# Altium schematic sheet Module-MCU.SchDoc
size A2; SheetNumber: 1; SheetTotal: 1
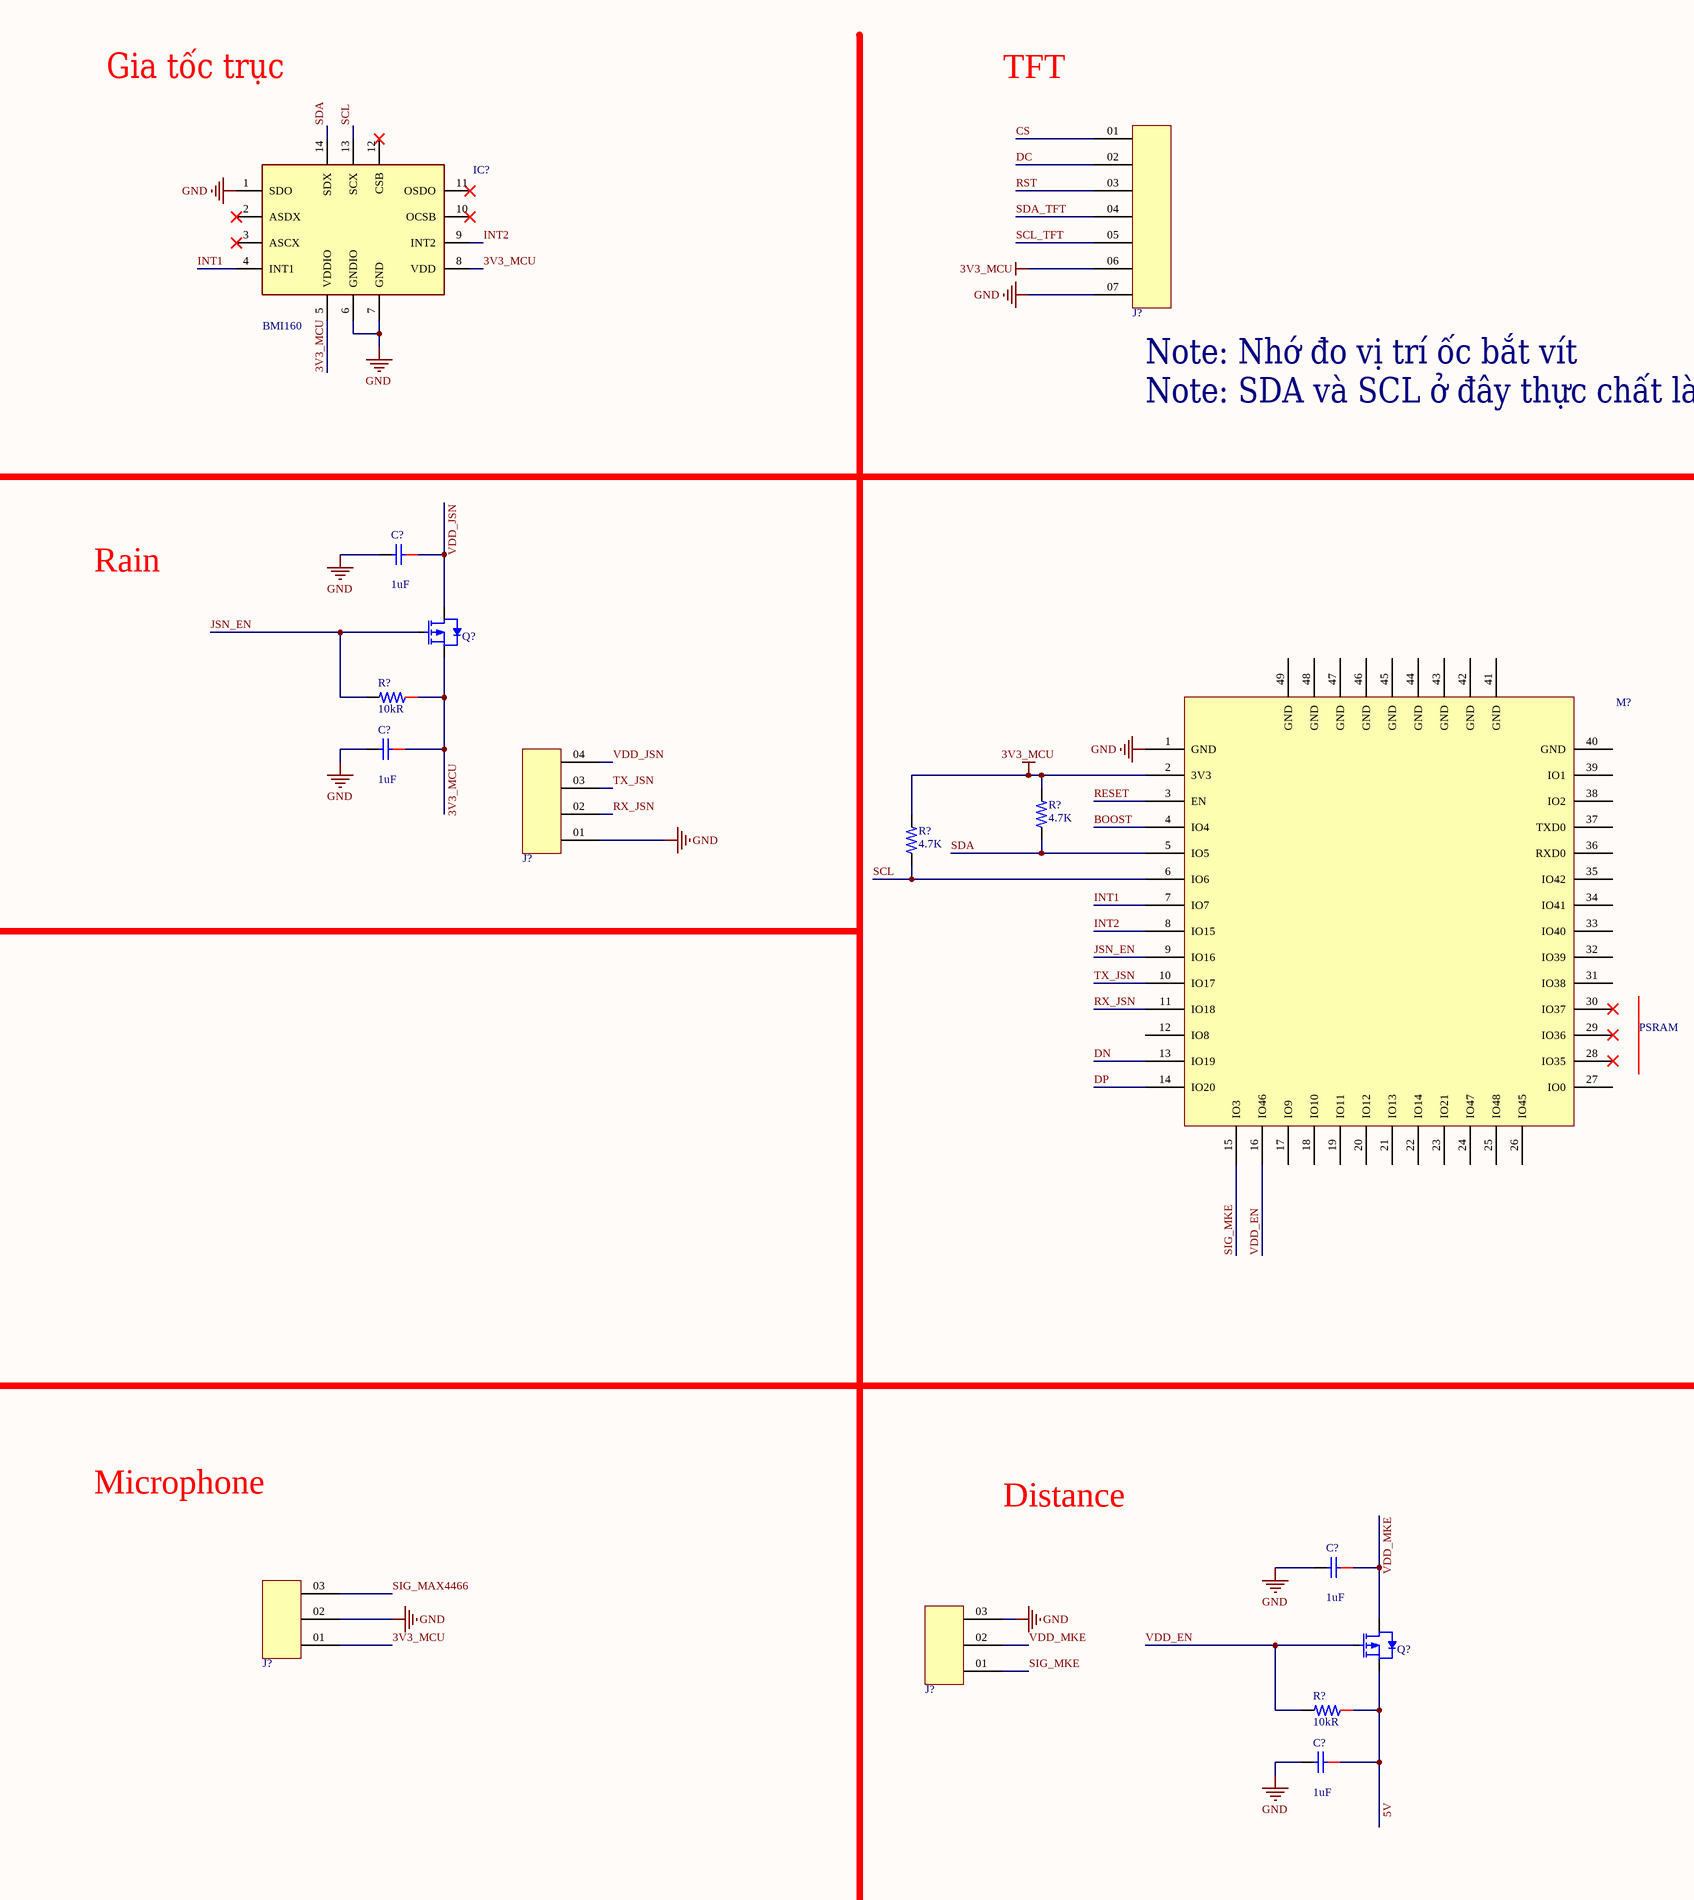
[diagram p0: Module-MCU.SchDoc, left]
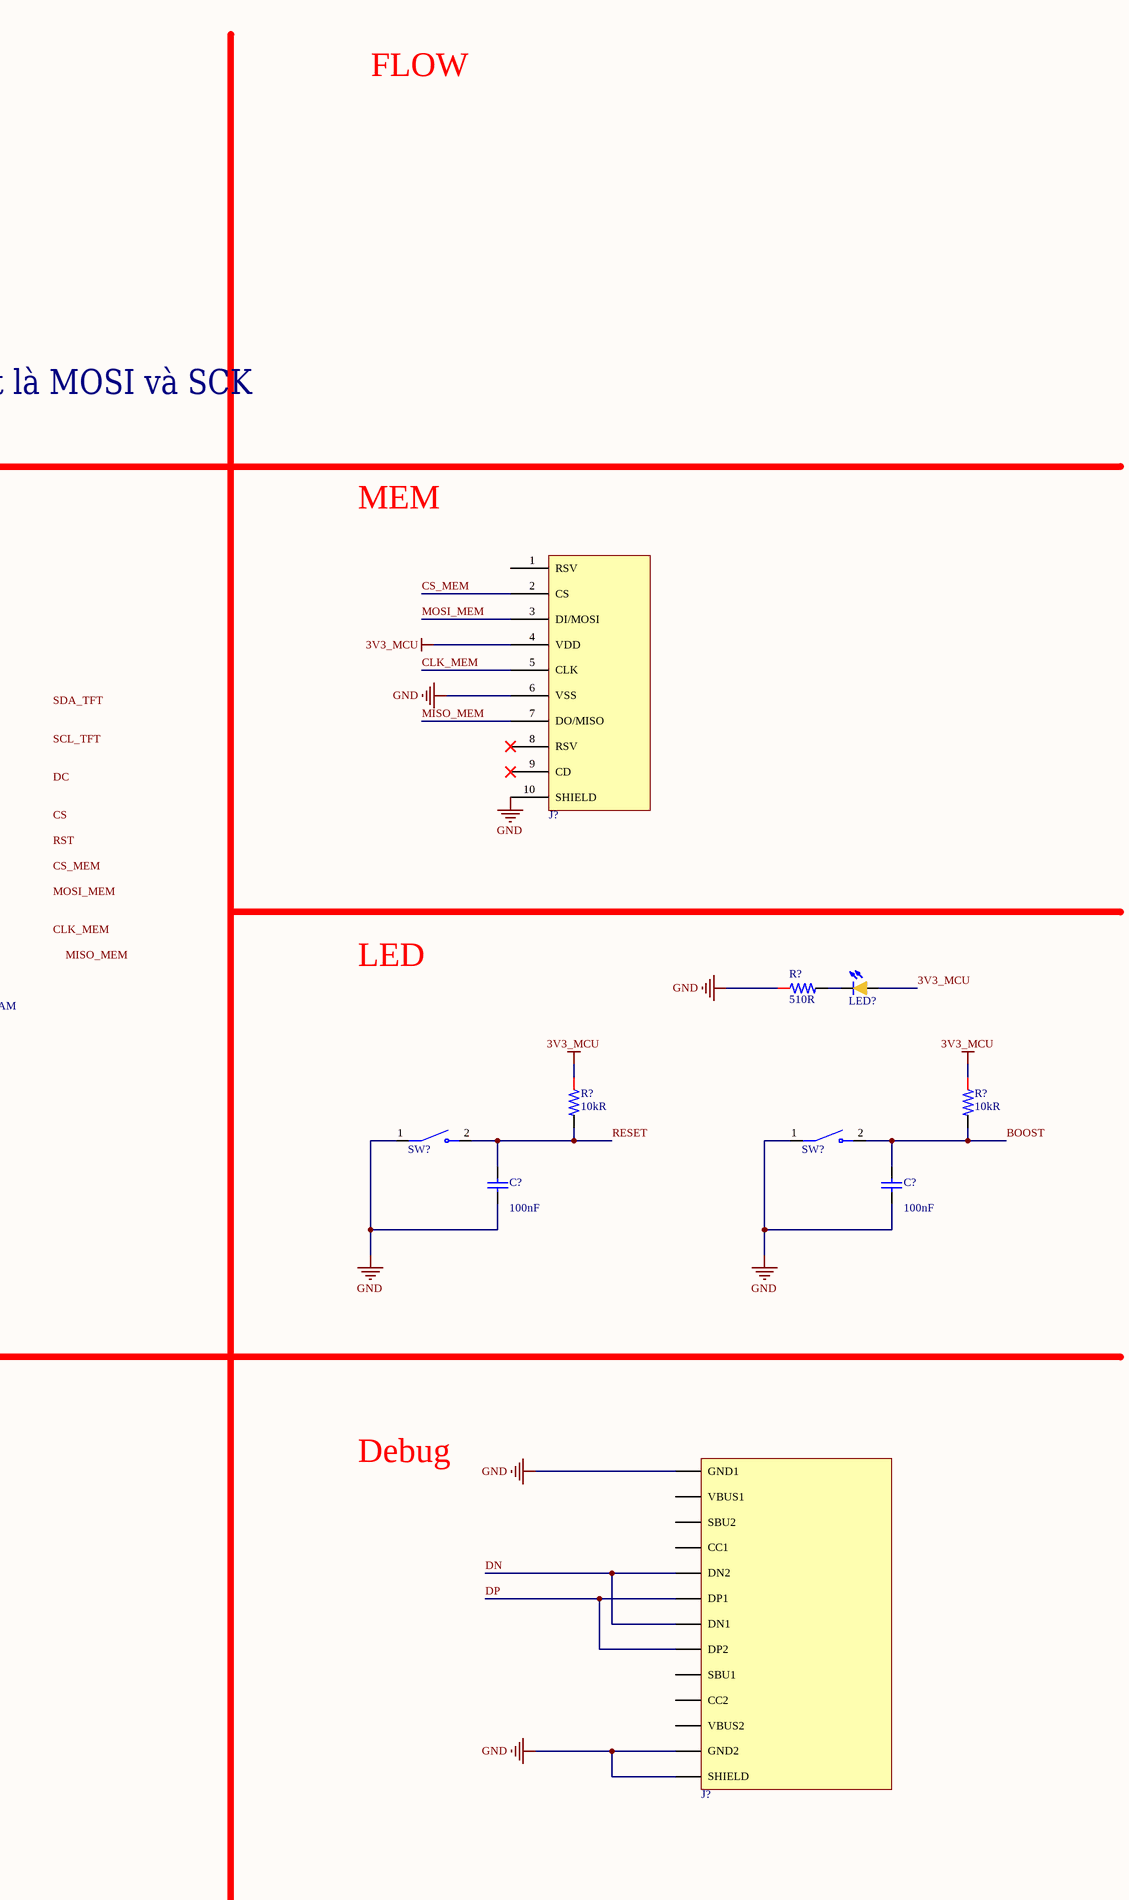
[diagram p1: Module-MCU.SchDoc, right]

## Parts
(Parts that share a designator on the sheet are numbered #1, #2 ... from top to bottom, then left to right.)
C?#1  value 1uF  [CAP_0603_YAGEO]  (hidden comment: 1 µF ±5% 16V Ceramic Capacitor X7R 0603 (1608 Metric))
C?#2  value 1uF  [CAP_0603_YAGEO]  (hidden comment: 1 µF ±5% 16V Ceramic Capacitor X7R 0603 (1608 Metric))
C?#3  value 100nF  [CAP_0603_YAGEO]  (hidden comment: 0.1 µF ±5% 16V Ceramic Capacitor X7R 0603 (1608 Metric))
C?#4  value 100nF  [CAP_0603_YAGEO]  (hidden comment: 0.1 µF ±5% 16V Ceramic Capacitor X7R 0603 (1608 Metric))
C?#5  value 1uF  [CAP_0603_YAGEO]  (hidden comment: 1 µF ±5% 16V Ceramic Capacitor X7R 0603 (1608 Metric))
C?#6  value 1uF  [CAP_0603_YAGEO]  (hidden comment: 1 µF ±5% 16V Ceramic Capacitor X7R 0603 (1608 Metric))
IC?  MP: BMI160  [VFLGA-14]  (hidden comment: Accelerometer, Gyroscope, 6 Axis Sensor I2C, SPI Output)
J?#1  Connector Header Through Hole 7 position 0.100" (2.54mm)  [HEADER-2.54-7]  (value not drawn)
J?#2  9 (8 + 1) Position Card Connector microSD™ Surface Mount, Right Angle Gold  [SD-CARD-9PIN-SMD]  (value not drawn)
J?#3  Connector Header Through Hole 4 position 0.100" (2.54mm)  [HEADER-2.54-4]  (value not drawn)
J?#4  USB-C (USB TYPE-C) USB 2.0 Receptacle Connector 24 (16+8 Dummy) Position Surface Mount, Right Angle; Through Hole  [TYPE-C-HOR-RECEPTACLE-24PIN-MOLEX]  (value not drawn)
J?#5  Connector Header Through Hole 3 position 0.100" (2.54mm)  [HEADER-2.54-3]  (value not drawn)
J?#6  Connector Header Through Hole 3 position 0.100" (2.54mm)  [HEADER-2.54-3]  (value not drawn)
LED?  Yellow-Green 572nm LED Indication - Discrete 2.2V 0603 (1608 Metric)  [LED_0603_ROHM]  (value not drawn)
M?  Bluetooth, WiFi 802.11b/g/n, Bluetooth v4.2 +EDR Transceiver Module 2.4GHz ~ 2.5GHz PCB Trace Surface Mount  [MODULE-ESP32-S3-WROOM-1-N16R8]  (value not drawn)
Q?#1  P-Channel 30 V 4A (Ta) 1.4W (Ta) Surface Mount SOT-23-3  [SOT23-3-AOEI]  (value not drawn)
Q?#2  P-Channel 30 V 4A (Ta) 1.4W (Ta) Surface Mount SOT-23-3  [SOT23-3-AOEI]  (value not drawn)
R?#1  value 10kR  [0603_YAGEO]  (hidden comment: 10 kOhms ±1% 0.1W, 1/10W Chip Resistor 0603 (1608 Metric) Moisture Resistant Thick Film)
R?#2  value 4.7K  [0603-RS]  (hidden comment: 4.7 kOhms ±1% 0.1W, 1/10W Chip Resistor 0603 (1608 Metric) Anti-Sulfur Thick Film)
R?#3  value 4.7K  [0603-RS]  (hidden comment: 4.7 kOhms ±1% 0.1W, 1/10W Chip Resistor 0603 (1608 Metric) Anti-Sulfur Thick Film)
R?#4  value 510R  [0603_YAGEO]  (hidden comment: 510 Ohms ±1% 0.1W, 1/10W Chip Resistor 0603 (1608 Metric) Moisture Resistant Thick Film)
R?#5  value 10kR  [0603_YAGEO]  (hidden comment: 10 kOhms ±1% 0.1W, 1/10W Chip Resistor 0603 (1608 Metric) Moisture Resistant Thick Film)
R?#6  value 10kR  [0603_YAGEO]  (hidden comment: 10 kOhms ±1% 0.1W, 1/10W Chip Resistor 0603 (1608 Metric) Moisture Resistant Thick Film)
R?#7  value 10kR  [0603_YAGEO]  (hidden comment: 10 kOhms ±1% 0.1W, 1/10W Chip Resistor 0603 (1608 Metric) Moisture Resistant Thick Film)
SW?#1  Tactile Switch SPST-NO Top Actuated Surface Mount  [SW_PTS636_SM43J_SMTR_LFS]  (value not drawn)
SW?#2  Tactile Switch SPST-NO Top Actuated Surface Mount  [SW_PTS636_SM43J_SMTR_LFS]  (value not drawn)

## Nets
3V3_MCU: C?#2.1 IC?.5(VDDIO) IC?.8(VDD) J?#1.06 J?#2.4(VDD) J?#5.01 LED?.A M?.2(3V3) Q?#1.2(S) R?#1.1 R?#2.2 R?#3.2 R?#5.1 R?#6.1
GND: C?#1.2 C?#2.2 C?#3.1 C?#4.1 C?#5.2 C?#6.2 IC?.1(SDO) IC?.6(GNDIO) IC?.7(GND) J?#1.07 J?#2.6(VSS) J?#2.10(SHIELD) J?#3.01 J?#4.A1B12(GND1) J?#4.B1A12(GND2) J?#4.SHIELD J?#5.02 J?#6.03 M?.1(GND) R?#4.1 SW?#1.1(COM) SW?#2.1(COM)
5V: C?#6.1 Q?#2.2(S) R?#7.1
BOOST: C?#4.2 M?.4(IO4) R?#6.2 SW?#2.2(NO)
CLK_MEM: J?#2.5(CLK)
CS: J?#1.01
CS_MEM: J?#2.2(CS)
DC: J?#1.02
DN: J?#4.A7(DN1) J?#4.B7(DN2) M?.13(IO19)
DP: J?#4.A6(DP1) J?#4.B6(DP2) M?.14(IO20)
INT1: IC?.4(INT1) M?.7(IO7)
INT2: IC?.9(INT2) M?.8(IO15)
JSN_EN: M?.9(IO16) Q?#1.1(G) R?#1.2
MISO_MEM: J?#2.7(DO/MISO)
MOSI_MEM: J?#2.3(DI/MOSI)
RESET: C?#3.2 M?.3(EN) R?#5.2 SW?#1.2(NO)
RST: J?#1.03
RX_JSN: J?#3.02 M?.11(IO18)
SCL: IC?.13(SCX) M?.6(IO6) R?#3.1
SCL_TFT: J?#1.05
SDA: IC?.14(SDX) M?.5(IO5) R?#2.1
SDA_TFT: J?#1.04
SIG_MAX4466: J?#5.03
SIG_MKE: J?#6.01 M?.15(IO3)
TX_JSN: J?#3.03 M?.10(IO17)
VDD_EN: M?.16(IO46) Q?#2.1(G) R?#7.2
VDD_JSN: C?#1.1 J?#3.04 Q?#1.3(D)
VDD_MKE: C?#5.1 J?#6.02 Q?#2.3(D)
NetLED?_C: LED?.C R?#4.2

Not connected (* = marked no-connect by the designer): IC? 2(ASDX)* 3(ASCX)* 10(OCSB)* 11(OSDO)* 12(CSB)*; J?#2 1(RSV) 8(RSV)* 9(CD)*; J?#4 A4B9(VBUS1) A5(CC1) A8(SBU1) B4A9(VBUS2) B5(CC2) B8(SBU2); M? 12(IO8) 17(IO9) 18(IO10) 19(IO11) 20(IO12) 21(IO13) 22(IO14) 23(IO21) 24(IO47) 25(IO48) 26(IO45) 27(IO0) 28(IO35)* 29(IO36)* 30(IO37)* 31(IO38) 32(IO39) 33(IO40) 34(IO41) 35(IO42) 36(RXD0) 37(TXD0) 38(IO2) 39(IO1) 40(GND) 41(GND) 42(GND) 43(GND) 44(GND) 45(GND) 46(GND) 47(GND) 48(GND) 49(GND)

## Notes on the sheet
- Gia tốc trục
- TFT
- FLOW
- (near J?#1) Note: Nhớ đo vị trí ốc bắt vít
- Note: SDA và SCL ở đây thực chất là MOSI và SCK
- MEM
- Rain
- LED
- PSRAM
- Microphone
- Distance
- Debug
- Labels drawn without touching a wire or pin: CLK_MEM, CS, CS_MEM, DC, MISO_MEM, MOSI_MEM, RST, SCL_TFT, SDA_TFT

## Library data of the parts
C?#1 C?#2 C?#5 C?#6 = CAP_CER; SMD; 1uF; 5%; 16V; 0603; CC0603JRX7R7BB105: Multilayer Ceramic Capacitor, 1 uF, 16 V, ï¿½ 5%, X7R, 0603 [1608 Metric]; Manufacturer: Yageo; Dielectric: 1511DielectricType; Library MADE By: Cong Le; Supplier: Digikey; Supplier Part Number: 311-3485-1-ND; Manufacturer Part Number: CC0603JRX7R7BB105; RoHS: Yes; Category: Ceramic Capacitors; Stock: 224935; Pricing: 1=0.17, 10=0.109, 50=0.069, 100=0.0552, 500=0.03986, 1000=0.03526 (USD); Voltage Rating (DC): 16V; Lead Free: 5697LeadFree; Halogen Free: 5694HalogenFree; ComponentLink1URL: http://www.yageo.com/documents/recent/UPY-GPHC_X7R_6.3V-to-50V_18.pdf?src-supplier=Digikey; ComponentLink1Description: http://www.yageo.com/documents/recent/UPY-GPHC_X7R_6.3V-to-50V_18.pdf?src-supplier=Digikey; ComponentLink2URL: https://www.yageo.com/upload/media/product/productsearch/datasheet/mlcc/UPY-GPHC_X7R_6.3V-to-50V_18.pdf?src-supplier=Digikey; ComponentLink2Description: https://www.yageo.com/upload/media/product/productsearch/datasheet/mlcc/UPY-GPHC_X7R_6.3V-to-50V_18.pdf?src-supplier=Digikey; ComponentLink3URL: https://datasheet.octopart.com/CC0603JRX7R7BB105-Yageo-datasheet-151948686.pdf?src-supplier=Farnell; ComponentLink3Description: https://datasheet.octopart.com/CC0603JRX7R7BB105-Yageo-datasheet-151948686.pdf?src-supplier=Farnell; ComponentLink4URL: https://datasheet.octopart.com/CC0603JRX7R7BB105-Yageo-datasheet-154741259.pdf?src-supplier=Future+Electronics; ComponentLink4Description: https://datasheet.octopart.com/CC0603JRX7R7BB105-Yageo-datasheet-154741259.pdf?src-supplier=Future+Electronics; Manufacture Cross: CC0603JRX7R7BB105; Manufacture Part Number Cross: YAGEO; ComponentLink5Description: Link Original; ComponentLink5URL: https://www.digikey.com/en/products/detail/yageo/CC0603JRX7R7BB105/7164369?s=N4IgTCBcDaIMJwAwDZEGYBSAlAGgdizwCEiBGRAVhAF0BfIA; ComponentLink6Description: Link Cross; ComponentLink6URL: https://www.lcsc.com/product-detail/Multilayer-Ceramic-Capacitors-MLCC-SMD-SMT_YAGEO-CC0603JRX7R7BB105_C519560.html; ComponentLink7Description: Link Viet Nam; ComponentLink7URL: https://banlinhkien.com/tu-0603-1051uf-50v-10-10c-p6646055.html
C?#3 C?#4 = CAP_CER; SMD; 100nF; 5%; 16V; 0603; CC0603JRX7R7BB104: Multilayer Ceramic Capacitor, 0.1 uF, 16 V, ± 5%, X7R, 0603 [1608 Metric]; Manufacturer: Yageo; Supplier: Digikey; Supplier Part Number: 311-1776-1-ND; Manufacturer Part Number: CC0603JRX7R7BB104; RoHS: Yes; Category: Ceramic Capacitors; Stock: 69960; Pricing: 1=0.1, 10=0.064, 50=0.0368, 100=0.0286, 500=0.0215, 1000=0.01689 (USD); Mounting Technology: Surface Mount; Case/Package: 0603; Pins: 2; Case Code (Metric): 1608; Case Code (Imperial): 0603; Min Operating Temperature: -55°C; Max Operating Temperature: 125°C; Tolerance: 5%; Voltage Rating: 16V; Packaging: Tape and Reel; Dielectric: X7R; Voltage Rating (DC): 16V; Series: CC; Length: 0.063inch; Width: 0.031inch; Thickness: 0.035inch; Depth: 0.8mm; Radiation Hardening: No; Lead Free: Lead Free; Halogen Free: Halogen Free; RoHS Compliant: Yes; ComponentLink1URL: https://datasheet.ciiva.com/26862/getdatasheetpartid-403543-26862779.pdf?src-supplier=Verical; ComponentLink1Description: https://datasheet.ciiva.com/26862/getdatasheetpartid-403543-26862779.pdf?src-supplier=Verical
IC? = SEN; BMI160: Accelerometer, Gyroscope, 6 Axis Sensor I²C, SPI Output; Designer: TVBac; Package: None; Price: None; Availability: Unavailable; Value: *; ComponentLink1Description: Link Digikey; ComponentLink1URL: https://www.digikey.com/en/products/detail/bosch-sensortec/BMI160/6136300
J?#1 = HEADER; 7PIN; 2.54; VER; TSW-107-14-L-S: Headers & Wire Housings Classic PCB Header Strips, 0.100 pitch; Manufacturer: Samtec; Designer: TVBac; Supplier: Digikey; Supplier Part Number: SAM1055-07-ND; Manufacturer Part Number: TSW-107-14-L-S; RoHS: Yes; Category: Connectors; Stock: 305; Pricing: 1=0.76, 10=0.66, 100=0.5438, 500=0.47284, 1000=0.39009, 5000=0.34281, 10000=0.31917 (USD); ComponentLink1URL: https://datasheet.ciiva.com/25618/0900766b81154476-25618446.pdf?src-supplier=Rs; ComponentLink1Description: https://datasheet.ciiva.com/25618/0900766b81154476-25618446.pdf?src-supplier=Rs; ComponentLink2Description: Link Digikey; ComponentLink2URL: https://www.digikey.com/en/products/detail/samtec-inc/TSW-107-14-L-S/1102617
J?#2 = SD-Card; SMD; SPI-MODE; MSD-1-A_1: Micro Sd Card Connector, 9 Posit; Manufacturer: CUI Devices; Designer: TVBac; Supplier: Digikey; Supplier Part Number: 2223-MSD-1-ACT-ND; Manufacturer Part Number: MSD-1-A; RoHS: No; Category: LDO; Stock: 2530; Pricing: 1=0.35, 10=0.348, 25=0.3408, 50=0.3204, 100=0.2727, 250=0.25224, 500=0.24544 (USD); ComponentLink1Description: Link Digikey; ComponentLink1URL: https://www.digikey.com/en/products/detail/same-sky-formerly-cui-devices/MSD-1-A/21799641
J?#3 = HEADER; 4PIN; 2.54; VER; TSW-104-14-L-S: Conn Unshrouded Header HDR 4 POS 2.54mm Solder ST Thru-Hole Automotive Bulk; Manufacturer: Samtec; Designer: TVBac; Supplier: Digikey; Supplier Part Number: SAM1055-04-ND; Manufacturer Part Number: TSW-104-14-L-S; RoHS: Yes; Category: Connectors; Stock: 1246; Pricing: 1=0.43, 10=0.377, 100=0.3107, 500=0.2702, 1000=0.22291, 5000=0.19589, 10000=0.18238 (USD); ComponentLink1URL: https://datasheet.ciiva.com/25618/0900766b81154476-25618487.pdf?src-supplier=Rs; ComponentLink1Description: https://datasheet.ciiva.com/25618/0900766b81154476-25618487.pdf?src-supplier=Rs; ComponentLink2URL: https://datasheet.ciiva.com/10190/htsw-th-10190703.pdf?src-supplier=Avnet; ComponentLink2Description: https://datasheet.ciiva.com/10190/htsw-th-10190703.pdf?src-supplier=Avnet; ComponentLink3Description: Link Digikey; ComponentLink3URL: https://www.digikey.com/en/products/detail/samtec-inc/TSW-104-14-L-S/1102620
J?#4 = Type-C; USB; HOR; RECEPTACLE;  24PIN; 217179-0001: USB Connector, 16 Contact(s), Female, Right Angle, Surface Mount Terminal, Locking, Receptacle; Manufacturer: Molex; USB Standard: USB 2.0; Current Rating: 1.25A; Number of Contacts: 16; Voltage Rating: 30V; Designer: TVBac; Supplier: Avnet; Supplier Part Number: 35AJ1973; Manufacturer Part Number: 217179-0001; RoHS: No; Category: Connectors; Stock: 7200; Pricing: 1=1.02, 25=0.853, 100=0.722, 250=0.677, 500=0.631 (USD); Contact Material: Nickel,Gold; Min Operating Temperature: -40°C; Max Operating Temperature: 85°C; Gender: Receptacle; Height: 3.36mm; ComponentLink1Description: Link Digikey; ComponentLink1URL: https://www.digikey.com/en/products/detail/molex/2171790001/13913749
J?#5 J?#6 = HEADER; 3PIN; 2.54; VER; TSW-103-14-L-S: Conn Unshrouded Header HDR 3 POS 2.54mm Solder ST Top Entry Thru-Hole Bag; Manufacturer: Samtec; Max Current Rating: 7.6A; Voltage Rating: 550V; Number of Positions: 3; Gender: Male; Designer: TVBac; Supplier: Digikey; Supplier Part Number: SAM1055-03-ND; Manufacturer Part Number: TSW-103-14-L-S; RoHS: Yes; Category: Connectors; Stock: 942; Pricing: 1=0.37, 10=0.319, 100=0.2482, 500=0.21278, 1000=0.17732, 5000=0.15198, 10000=0.14185 (USD); Mounting Technology: Through Hole; Contact Plating: Gold; Contact Material: Bronze; Housing Color: Black; Housing Material: Polyester; Contact Shape: Square; Contact Finish - Mating: GOLD; Insulation Material: PBT; Insulation Color: Black; Min Operating Temperature: -55°C; Max Operating Temperature: 125°C; Number of Rows: 1; Packaging: Bulk; Current Rating: 7.6A; Termination: Solder; Number of Contacts: 3; Max Voltage Rating (AC): 550V; Orientation: Straight; Connector Type: Header; Series: TSW; Contact Type: Male Pin; Fastening Type: Pull; Length: 7.62mm; Width: 2.54mm; Pitch: 2.54mm; Depth: 2.54mm; Reach SVHC Compliant: No; Lead Free: Lead Free; RoHS Compliant: Yes; Flammability Rating: UL94 V-0; ComponentLink1URL: https://datasheet.ciiva.com/25618/0900766b81154476-25618314.pdf?src-supplier=Rs; ComponentLink1Description: https://datasheet.ciiva.com/25618/0900766b81154476-25618314.pdf?src-supplier=Rs; ComponentLink2URL: https://datasheet.ciiva.com/6860/tsw-xxx-xx-xxx-x-xx-xxx-mkt-6860061.pdf?src-supplier=Digikey; ComponentLink2Description: https://datasheet.ciiva.com/6860/tsw-xxx-xx-xxx-x-xx-xxx-mkt-6860061.pdf?src-supplier=Digikey; ComponentLink3Description: Link Digikey; ComponentLink3URL: https://www.digikey.com/en/products/detail/samtec-inc/TSW-103-14-L-S/1102621
LED? = LED_YELOW; SMD; 0603; SML-D12M1WT86: LED Uni-Color Yellow Green 2-Pin Chip 0603(1608Metric) T/R; Manufacturer: Rohm; Manufacture Cross: ROHM Semicon; Forward Current: 20mA; Power Dissipation: 54mW; Reverse Voltage: 5V; Library MADE By: Cong Le; Supplier: Digikey; Supplier Part Number: SML-D12M1WT86CT-ND; Manufacturer Part Number: SML-D12M1WT86; RoHS: Yes; Category: LEDs; Stock: 114320; Pricing: 1=0.21, 10=0.116, 100=0.0689, 500=0.05074, 1000=0.04519 (USD); Min Operating Temperature: -40°C; Max Operating Temperature: 85°C; Wavelength: 572nm; Lead Free: 5697LeadFree; ComponentLink1URL: https://datasheet.octopart.com/SML-D12M1WT86-Rohm-datasheet-138791993.pdf?src-supplier=Future+Electronics; ComponentLink1Description: https://datasheet.octopart.com/SML-D12M1WT86-Rohm-datasheet-138791993.pdf?src-supplier=Future+Electronics; ComponentLink2URL: https://www.rohm.com/datasheet/SML-D12M1W?src-supplier=Digikey; ComponentLink2Description: https://www.rohm.com/datasheet/SML-D12M1W?src-supplier=Digikey; ComponentLink3URL: https://datasheet.octopart.com/SML-D12M1WT86-Rohm-datasheet-142144710.pdf?src-supplier=TME; ComponentLink3Description: https://datasheet.octopart.com/SML-D12M1WT86-Rohm-datasheet-142144710.pdf?src-supplier=TME; Manufacture Part Number Cross: ROHM Semicon; ComponentLink4Description: Link Original; ComponentLink4URL: https://www.digikey.com/en/products/detail/rohm-semiconductor/sml-d12m1wt86/5843856; ComponentLink5Description: Link Cross; ComponentLink5URL: https://www.lcsc.com/product-detail/LED-Indication-Discrete_ROHM-Semicon-SML-D12M1WT86_C2922668.html; ComponentLink6Description: Link Viet Nam; ComponentLink6URL: https://linhkienviet.vn/led-0603-vang
M? = ESP32-S3-WROOM-1-N16R8; SMD;: SMD mod, ESP32-S3R8 with 3.3V, 8MB Octal PSRAM die insid, 6MBQuad SPI flash, pcb ant; Manufacturer: Espressif Systems; Designer: TVBac; Supplier: Digikey; Supplier Part Number: 1965-ESP32-S3-WROOM-1-N16R8CT-ND; Manufacturer Part Number: ESP32-S3-WROOM-1-N16R8; RoHS: No; Category: LDO; Stock: 8003; Pricing: 1=3.9 (USD); ComponentLink1Description: Link Digikey; ComponentLink1URL: https://www.digikey.com/en/products/detail/espressif-systems/ESP32-S3-WROOM-1-N16R8/16162642
Q?#1 Q?#2 = SMD; AO3401A; MOSFET; P-CH;: Transistor: P-MOSFET; unipolar; -30V; 4, 2A; 1, 4W; 85 mOhm; ; -55+150 st.C; SMD; SOT23; Manufacturer: Alpha & Omega Semiconductor; Rds On Max: 44mR; Input Capacitance: 1.2nF; Drain to Source Voltage (Vdss): 30V; Number of Elements: 1; Drain to Source Resistance: 41mR; Gate to Source Voltage (Vgs): 12V; Number of Channels: 1NUMBER; Threshold Voltage: -900mV; Turn-Off Delay Time: 41ns; Turn-On Delay Time: 6.5ns; Supplier: Digikey; Supplier Part Number: 785-1001-1-ND; Manufacturer Part Number: AO3401A; RoHS: Yes; Category: MOSFETs; Stock: 544768; Pricing: 1=0.46, 10=0.282, 100=0.1787, 500=0.1337, 1000=0.11915 (USD); Mounting Technology: Surface Mount; Case/Package: TO-236-3; Pins: 3; Min Operating Temperature: -55°C; Max Operating Temperature: 150°C; Packaging: Cut Tape; Continuous Drain Current (ID): 4A; Max Power Dissipation: 1.4W; Power Dissipation: 1.4W; Series: -; Drain to Source Breakdown Voltage: -30V; Height: 1.25mm; Radiation Hardening: No; Lead Free: Lead Free; RoHS Compliant: Yes; ComponentLink1URL: https://datasheet.ciiva.com/940/ao3401a-940720.pdf?src-supplier=Digikey; ComponentLink1Description: https://datasheet.ciiva.com/940/ao3401a-940720.pdf?src-supplier=Digikey; ComponentLink2URL: https://datasheet.ciiva.com/26927/getdatasheetpartid-79048-26927888.pdf?src-supplier=Verical; ComponentLink2Description: https://datasheet.ciiva.com/26927/getdatasheetpartid-79048-26927888.pdf?src-supplier=Verical; Package: SOT23-3
R?#1 R?#5-R?#7 = RES; SMD; 10K; 1%; 1/10W; 0603; RC0603FR-0710KL: SMD Chip Resistor, 10 kOhm, ï¿½ 1%, 100 mW, 0603 [1608 Metric], Thick Film, General Purpose; Manufacturer: Yageo; Voltage Rating (DC): 50V; Temperature Coefficient: 100ppm/°C; Voltage Rating: 75V; Power Rating: 100mW; Library MADE By: Cong Le; Supplier: Future Electronics; Supplier Part Number: 4023214; Manufacturer Part Number: RC0603FR-0710KL; RoHS: Yes; Category: Chip SMD Resistors; Stock: 33080000; Pricing: 5000=0.0014, 50000=0.0014, 150000=0.0013, 375000=0.0013, 1000000=0.0012 (USD); Case/Package: 0603; Pins: 2; Case Code (Imperial): 0603; Case Code (Metric): 1608; Weight: 7.1E-05oz; Min Operating Temperature: -55°C; Max Operating Temperature: 155°C; Tolerance: 1%; Packaging: Tape and Reel; Termination: SMD/SMT; Resistor Type: Thick Film; Features: Moisture Resistant; Series: RC; Max Power Dissipation: 100mW; Number of Terminations: 2; Resistance Tolerance: 1%; Construction: Rectangular; Length: 1.6mm; Width: 0.8mm; Height: 0.45mm; Depth: 0.8mm; Lead Pitch: 0.3mm; Reach SVHC Compliant: No; Lead Free: Lead Free; Military Standard: Not; RoHS Compliant: Yes; ComponentLink1URL: https://datasheet.ciiva.com/15189/getdatasheetpartid-409289-15189591.pdf?src-supplier=Verical; ComponentLink1Description: https://datasheet.ciiva.com/15189/getdatasheetpartid-409289-15189591.pdf?src-supplier=Verical; ComponentLink2URL: https://datasheet.ciiva.com/7746/1738695-7746239.pdf?src-supplier=Element14; ComponentLink2Description: https://datasheet.ciiva.com/7746/1738695-7746239.pdf?src-supplier=Element14; ComponentLink3URL: https://datasheet.ciiva.com/7983/443971-7983596.pdf?src-supplier=Element14; ComponentLink3Description: https://datasheet.ciiva.com/7983/443971-7983596.pdf?src-supplier=Element14; ComponentLink4URL: https://datasheet.ciiva.com/22747/443971-22747519.pdf?src-supplier=Element14; ComponentLink4Description: https://datasheet.ciiva.com/22747/443971-22747519.pdf?src-supplier=Element14; ComponentLink5URL: https://datasheet.ciiva.com/46440/1868787-46440891.pdf?src-supplier=Element14; ComponentLink5Description: https://datasheet.ciiva.com/46440/1868787-46440891.pdf?src-supplier=Element14; ComponentLink6URL: https://datasheet.ciiva.com/7660/38590-7660789.pdf?src-supplier=Element14; ComponentLink6Description: https://datasheet.ciiva.com/7660/38590-7660789.pdf?src-supplier=Element14; Manufacture Cross: YAGEO; Manufacture Part Number Cross: RC0603FR-0710KL; ComponentLink7Description: Link Original; ComponentLink7URL: https://www.digikey.com/en/products/detail/yageo/RC0603FR-0710KL/726880; ComponentLink8Description: Link Cross; ComponentLink8URL: https://www.lcsc.com/product-detail/Chip-Resistor-Surface-Mount_YAGEO-RC0603FR-0710KL_C98220.html; ComponentLink9Description: Link Viet Nam; ComponentLink9URL: https://linhkienchatluong.vn/dien-tro-dan-0603-116w-1/dien-tro-dan-0603-10k-1-50c_sp836_ct5792.aspx
R?#2 R?#3 = RES; SMD; 4.7K; 0603; SFR03EZPF4701: Res Anti-Sulfured Thick Film 0603 4.7k Ohm 1% 1/10W ±100ppm/°C Molded Paper T/R; Manufacturer: Rohm; Power Rating: 100mW; Voltage Rating (DC): 50V; Designer: TVBac; Supplier: Mouser; Supplier Part Number: 755-SFR03EZPF4701; Manufacturer Part Number: SFR03EZPF4701; RoHS: Yes; Category: Chip SMD Resistors; Stock: 30180; Pricing: 1=0.14, 10=0.045, 50=0.045, 100=0.027, 1000=0.02, 10000=0.014 (USD); ComponentLink1URL: http://www.farnell.com/datasheets/2611943.pdf?src-supplier=Farnell; ComponentLink1Description: http://www.farnell.com/datasheets/2611943.pdf?src-supplier=Farnell; ComponentLink2URL: http://www.farnell.com/datasheets/2611943.pdf?src-supplier=Newark; ComponentLink2Description: http://www.farnell.com/datasheets/2611943.pdf?src-supplier=Newark; ComponentLink3URL: http://www.farnell.com/datasheets/2611943.pdf?src-supplier=Element14; ComponentLink3Description: http://www.farnell.com/datasheets/2611943.pdf?src-supplier=Element14; ComponentLink4URL: https://www.rohm.com/datasheet/SFR03EZPF/sfr-e?src-supplier=Digikey; ComponentLink4Description: https://www.rohm.com/datasheet/SFR03EZPF/sfr-e?src-supplier=Digikey; ComponentLink5Description: Link Digikey; ComponentLink5URL: https://www.digikey.com/en/products/detail/rohm-semiconductor/SFR03EZPF4701/9771855
R?#4 = RES; SMD; 510R; 1%; 0603; 1/10W; RC0603FR-07510RL: 100Mw Thick Film Resistors 100Ppm/ 1% 510 0603 Chip Resistor Surface Mount Rohs; Manufacturer: Yageo; Temperature Coefficient: 100ppm/°C; Voltage Rating: 75V; Voltage Rating (DC): 50V; Library MADE By: Cong Le; Supplier: Newark; Supplier Part Number: 21AM7137; Manufacturer Part Number: RC0603FR-07510RL; RoHS: Yes; Category: Chip SMD Resistors; Case/Package: 0603; Pins: 2; Contact Plating: Tin,Matte; Case Code (Imperial): 0603; Weight: 7.1E-05oz; Case Code (Metric): 1608; Min Operating Temperature: -55°C; Max Operating Temperature: 155°C; Tolerance: 1%; Power Rating: 100mW; Packaging: Tape and Reel; Termination: SMD/SMT; Resistor Type: Thick Film; Features: Moisture Resistant; Series: RC; Max Power Dissipation: 100mW; Number of Terminations: 2; Resistance Tolerance: 1%; Technology: THICK FILM; Length: 1.6mm; Width: 0.8mm; Height: 0.45mm; Depth: 0.8mm; Reach SVHC Compliant: No; Lead Free: 5697LeadFree; RoHS Compliant: Yes; ComponentLink1URL: https://datasheet.ciiva.com/11808/0900766b80f96399-11808268.pdf?src-supplier=Rs; ComponentLink1Description: https://datasheet.ciiva.com/11808/0900766b80f96399-11808268.pdf?src-supplier=Rs; ComponentLink2URL: https://datasheet.ciiva.com/46395/443971-46395013.pdf?src-supplier=Element14; ComponentLink2Description: https://datasheet.ciiva.com/46395/443971-46395013.pdf?src-supplier=Element14; ComponentLink3URL: https://datasheet.ciiva.com/8883/pyu-rc0603-51-rohs-l-4-8883078.pdf?src-supplier=Avnet; ComponentLink3Description: https://datasheet.ciiva.com/8883/pyu-rc0603-51-rohs-l-4-8883078.pdf?src-supplier=Avnet; Manufacture Part Number Cross: *; Manufacture Cross: *; ComponentLink4Description: Link Viet Nam; ComponentLink4URL: https://linhkienchatluong.vn/dien-tro-dan-0603-116w-1/dien-tro-dan-0603-510r-1-50c_sp836_ct8908.aspx; ComponentLink5Description: Link Cross; ComponentLink5URL: *; ComponentLink6Description: Link Original; ComponentLink6URL: https://www.digikey.com/en/products/detail/yageo/RC0603FR-07510RL/727285?s=N4IgTCBcDaIEoGEAMA2JBmAYnAtEg7AKwCMScAMiALoC%2BQA
SW?#1 SW?#2 = SW; SMD; 6x3 mm; PTS636SM50JSMTRLFS: Switch Tactile N.O. SPST Rectangular Button J-Bend 0.05A 12VDC 1.77N SMD T/R; Manufacturer: ITT C&K; Manufacture Cross: C&K; Contact Resistance: 100mR; Number of Positions: 2NUMBER; Library MADE By: Cong Le; Supplier: Mouser; Supplier Part Number: 611-PTS636SM50JSMTRL; Manufacturer Part Number: PTS636SM50JSMTRLFS; RoHS: No; Category: Tactile Switches; Stock: 5758; Pricing: 1=0.19, 10=0.167, 50=0.167, 100=0.143, 500=0.13, 1000=0.112, 1500=0.095, 10000=0.092 (USD); Manufacture Part Number Cross: PTS636 SM50J SMTR LFS; ComponentLink1Description: Link Original; ComponentLink1URL: https://www.digikey.com/en/products/detail/c-k/PTS636-SM50J-SMTR-LFS/10071732; ComponentLink2Description: Link Cross; ComponentLink2URL: https://www.lcsc.com/product-detail/Tactile-Switches_C-K-PTS636-SM50J-SMTR-LFS_C2801469.html; ComponentLink3Description: Link Viet Nam; ComponentLink3URL: https://linhkien.cxt.vn/1780-nut-nhan-smd-2p-3x6x43mm-10c.html